# Altium schematic sheet Digital Part.SchDoc
size A3; DocumentNumber: 1; SheetNumber: 1; SheetTotal: 4
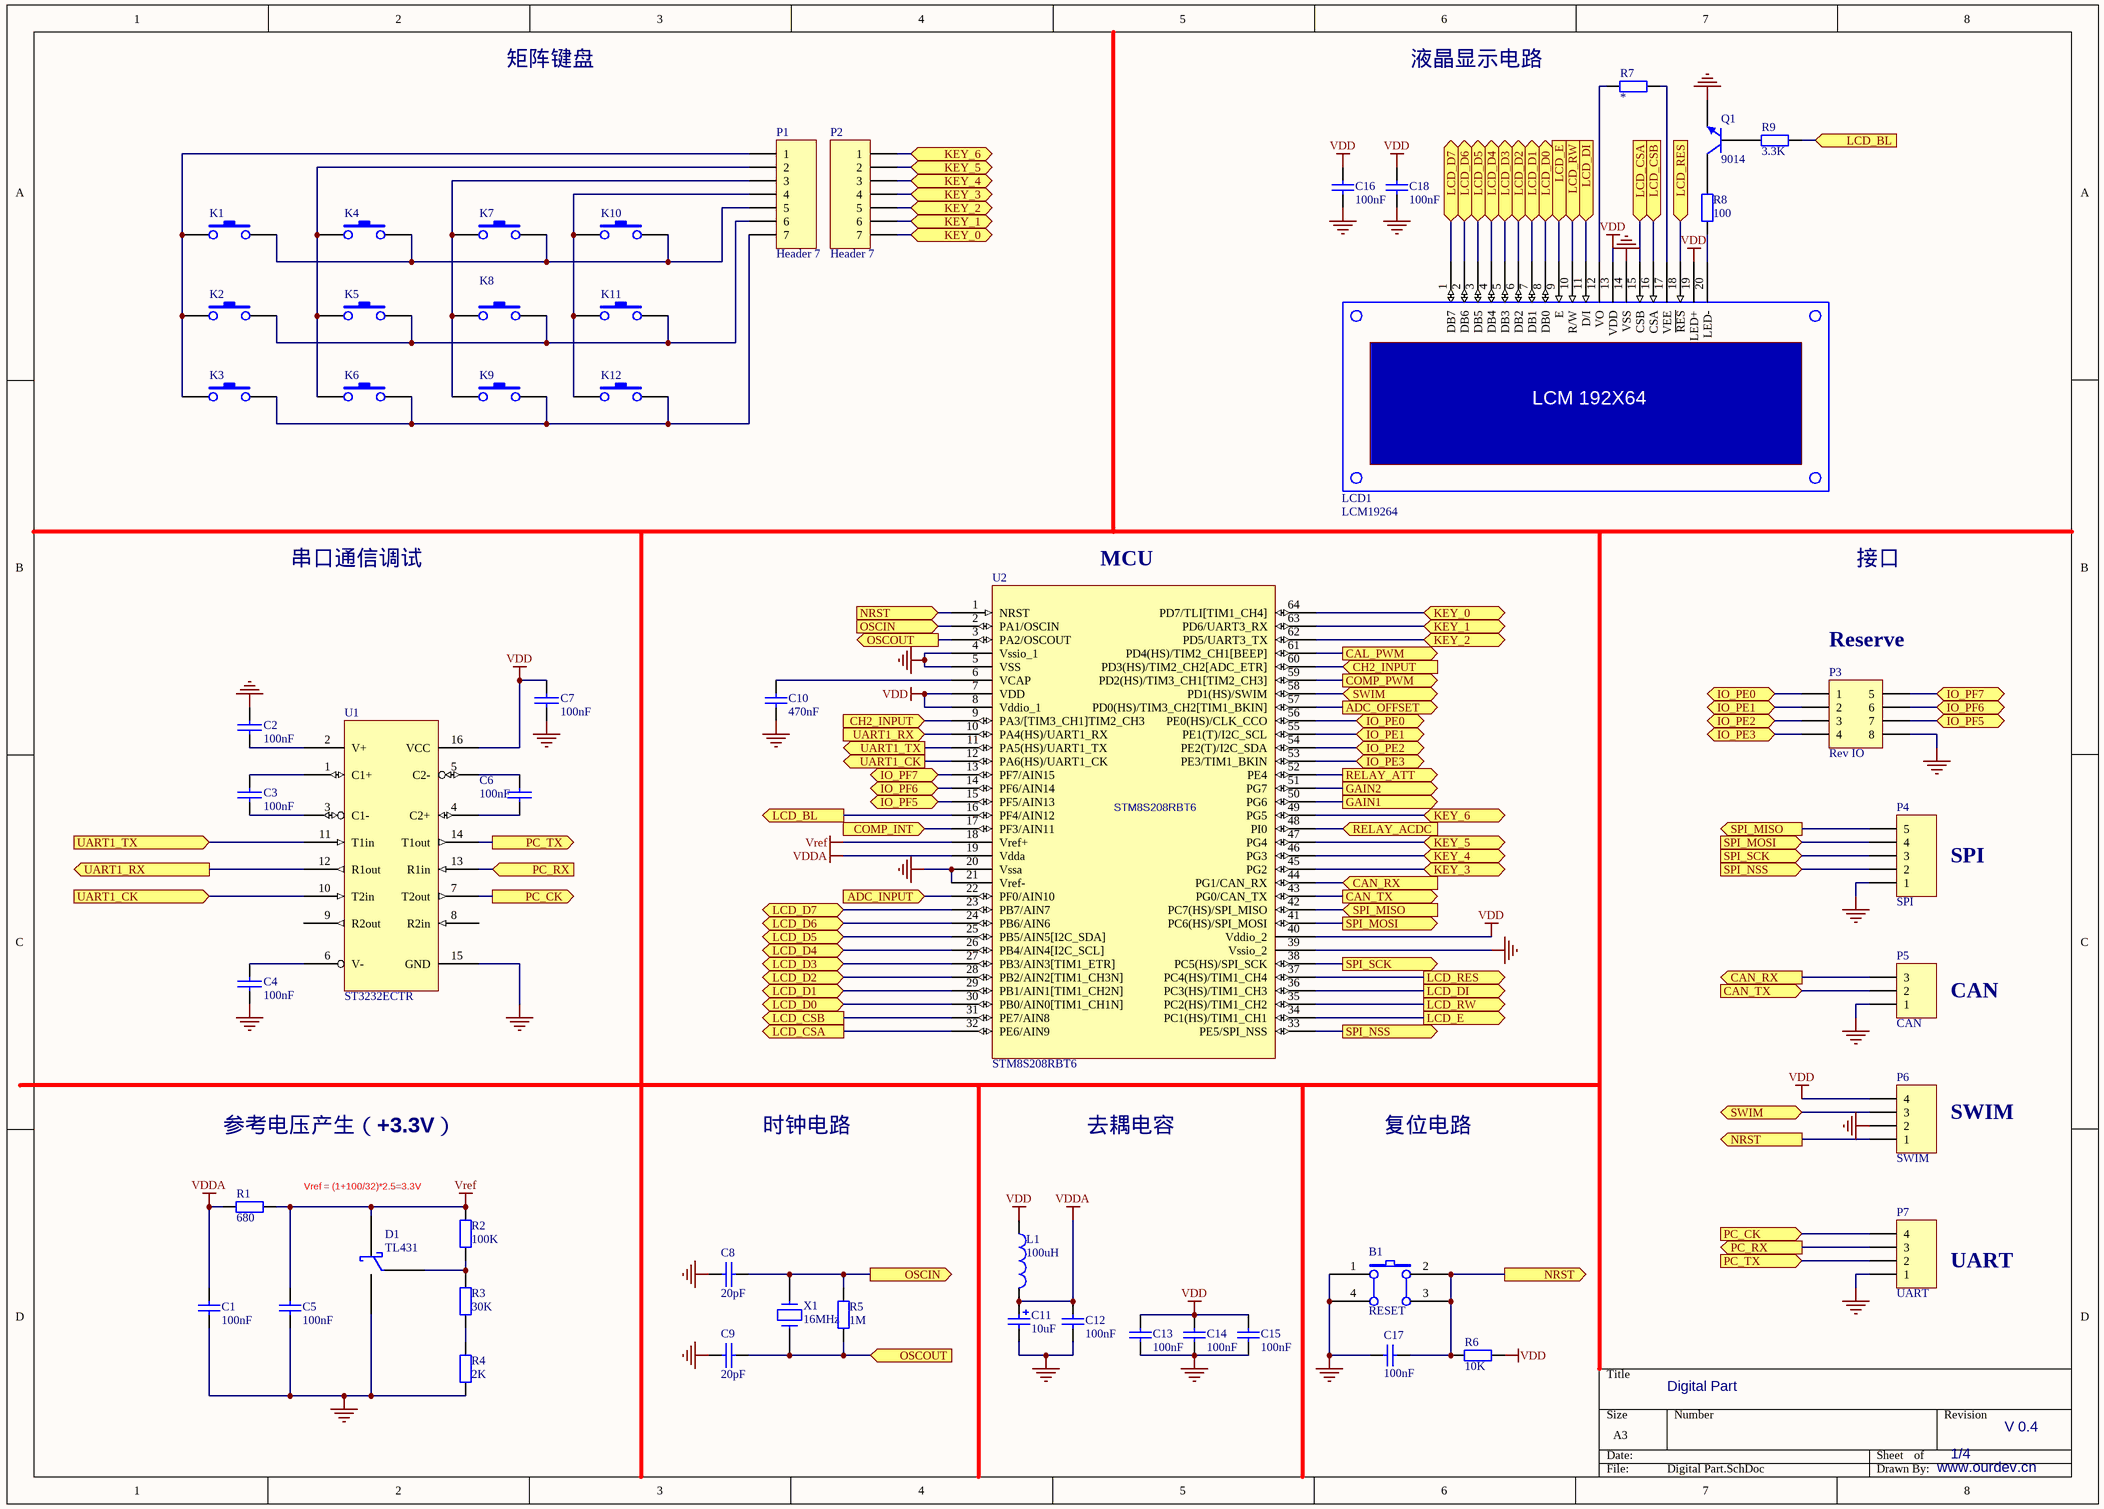
[diagram p0: Digital Part.SchDoc]

## Parts
B1  RESET  [PB-2]
C1  100nF  [CC2012-0805]
C2  100nF  [CC2012-0805]
C3  100nF  [CC2012-0805]
C4  100nF  [CC2012-0805]
C5  100nF  [CC2012-0805]
C6  100nF  [CC2012-0805]
C7  100nF  [CC2012-0805]
C8  20pF  [CC2012-0805]
C9  20pF  [CC2012-0805]
C10  470nF  [CC2012-0805]
C11  10uF  [C-1206]
C12  100nF  [CC2012-0805]
C13  100nF  [CC2012-0805]
C14  100nF  [CC2012-0805]
C15  100nF  [CC2012-0805]
C16  100nF  [CC2012-0805]
C17  100nF  [CC2012-0805]
C18  100nF  [CC2012-0805]
D1  TL431  [SOT-89]
K1  (no value)  [PB-2]
K2  (no value)  [PB-2]
K3  (no value)  [PB-2]
K4  (no value)  [PB-2]
K5  (no value)  [PB-2]
K6  (no value)  [PB-2]
K7  (no value)  [PB-2]
K8  (no value)  [PB-2]
K9  (no value)  [PB-2]
K10  (no value)  [PB-2]
K11  (no value)  [PB-2]
K12  (no value)  [PB-2]
L1  100uH  [L-1206]
LCD1  LCM19264  [HDR2X10]
P1  Header 7  [HDR1X7]
P2  Header 7  [HDR1X7]
P3  Rev IO  [HDR2X4_CEN]
P4  SPI  [HDR1X5]
P5  CAN  [HDR1X3]
P6  SWIM  [HDR1X4]
P7  UART  [HDR1X4]
Q1  9014  [SOT-23]
R1  680  [CR2012-0805]
R2  100K  [CR2012-0805]
R3  30K  [CR2012-0805]
R4  2K  [CR2012-0805]
R5  1M  [CR2012-0805]
R6  10K  [CR2012-0805]
R7  *  [CR2012-0805]
R8  value 100  [CR2012-0805]  (hidden comment: 3.3K)
R9  3.3K  [CR2012-0805]
U1  ST3232ECTR  [SO-16]
U2  STM8S208RBT6  [TQFP-64]
X1  16MHz  [CRYSTAL]

## Ports
ADC_INPUT (in), ADC_OFFSET (out), CAL_PWM (out), CAN_RX (in), CAN_RX (out), CAN_TX (in), CAN_TX (out), CH2_INPUT (in), COMP_INT (in), COMP_PWM (out), GAIN1 (out), GAIN2 (out), IO_PE0 (bidir), IO_PE1 (bidir), IO_PE2 (bidir), IO_PE3 (bidir), IO_PF5 (bidir), IO_PF6 (bidir), IO_PF7 (bidir), KEY_0, KEY_1, KEY_2, KEY_3, KEY_4, KEY_5, KEY_6, LCD_BL (in), LCD_BL (out), LCD_CSA (in), LCD_CSA (out), LCD_CSB (in), LCD_CSB (out), LCD_D0, LCD_D0 (bidir), LCD_D1, LCD_D2, LCD_D2 (bidir), LCD_D3, LCD_D4, LCD_D5, LCD_D6, LCD_D6 (bidir), LCD_D7, LCD_D7 (bidir), LCD_DI (in), LCD_DI (out), LCD_E (in), LCD_E (out), LCD_RES (in), LCD_RES (out), LCD_RW (in), LCD_RW (out), NRST (in), NRST (out), OSCIN (in), OSCIN (out), OSCOUT (in), OSCOUT (out), PC_CK (in), PC_CK (out), PC_RX (in), PC_RX (out), PC_TX (in), PC_TX (out), RELAY_ACDC (in), RELAY_ATT (out), SPI_MISO (in), SPI_MISO (out), SPI_MOSI (in), SPI_MOSI (out), SPI_NSS (in), SPI_NSS (out), SPI_SCK (in), SPI_SCK (out), SWIM (bidir), UART1_CK (in), UART1_CK (out), UART1_RX (in), UART1_RX (out), UART1_TX (in), UART1_TX (out)

## Nets
GND: B1.1(A0) B1.4(A1) C1.2 C2.1 C4.1 C5.2 C7.2 C8.2 C9.2 C10.1 C11.2 C12.2 C13.2 C14.2 C15.2 C16.2 C17.1 C18.2 D1.2(ANODE) LCD1.14(VSS) P3.8 P4.1 P5.1 P6.2 P7.1 Q1.2(E) R4.2 U1.15(GND) U2.4(Vssio_1) U2.5(VSS) U2.20(Vssa) U2.21(Vref-) U2.39(Vssio_2)
VDD: C7.1 C13.1 C14.1 C15.1 C16.1 C18.1 L1.1 LCD1.13(VDD) LCD1.19(LED+) P6.4 R6.1 U1.16(VCC) U2.7(VDD) U2.8(Vddio_1) U2.40(Vddio_2)
VDDA: C1.1 C11.1 C12.1 L1.2 R1.1 U2.19(Vdda)
Vref: C5.1 D1.3(CATHODE) R1.2 R2.1 U2.18(Vref+)
ADC_INPUT: U2.22(PF0/AIN10) ; port ADC_INPUT
ADC_OFFSET: U2.57(PD0(HS)/TIM3_CH2[TIM1_BKIN]) ; port ADC_OFFSET
CAL_PWM: U2.61(PD4(HS)/TIM2_CH1[BEEP]) ; port CAL_PWM
CAN_RX: P5.3 U2.44(PG1/CAN_RX) ; port CAN_RX
CAN_TX: P5.2 U2.43(PG0/CAN_TX) ; port CAN_TX
CH2_INPUT: U2.9(PA3/[TIM3_CH1]TIM2_CH3) U2.60(PD3(HS)/TIM2_CH2[ADC_ETR]) ; port CH2_INPUT
COMP_INT: U2.17(PF3/AIN11) ; port COMP_INT
COMP_PWM: U2.59(PD2(HS)/TIM3_CH1[TIM2_CH3]) ; port COMP_PWM
GAIN1: U2.50(PG6) ; port GAIN1
GAIN2: U2.51(PG7) ; port GAIN2
IO_PE0: P3.1 U2.56(PE0(HS)/CLK_CCO) ; port IO_PE0
IO_PE1: P3.2 U2.55(PE1(T)/I2C_SCL) ; port IO_PE1
IO_PE2: P3.3 U2.54(PE2(T)/I2C_SDA) ; port IO_PE2
IO_PE3: P3.4 U2.53(PE3/TIM1_BKIN) ; port IO_PE3
IO_PF5: P3.7 U2.15(PF5/AIN13) ; port IO_PF5
IO_PF6: P3.6 U2.14(PF6/AIN14) ; port IO_PF6
IO_PF7: P3.5 U2.13(PF7/AIN15) ; port IO_PF7
KEY_0: P2.7 U2.64(PD7/TLI[TIM1_CH4]) ; port KEY_0
KEY_1: P2.6 U2.63(PD6/UART3_RX) ; port KEY_1
KEY_2: P2.5 U2.62(PD5/UART3_TX) ; port KEY_2
KEY_3: P2.4 U2.45(PG2) ; port KEY_3
KEY_4: P2.3 U2.46(PG3) ; port KEY_4
KEY_5: P2.2 U2.47(PG4) ; port KEY_5
KEY_6: P2.1 U2.49(PG5) ; port KEY_6
LCD_BL: R9.1 U2.16(PF4/AIN12) ; port LCD_BL
LCD_CSA: LCD1.15(CSB) U2.32(PE6/AIN9) ; port LCD_CSA
LCD_CSB: LCD1.16(CSA) U2.31(PE7/AIN8) ; port LCD_CSB
LCD_D0: LCD1.8(DB0) U2.30(PB0/AIN0[TIM1_CH1N]) ; port LCD_D0
LCD_D1: LCD1.7(DB1) U2.29(PB1/AIN1[TIM1_CH2N]) ; port LCD_D1
LCD_D2: LCD1.6(DB2) U2.28(PB2/AIN2[TIM1_CH3N]) ; port LCD_D2
LCD_D3: LCD1.5(DB3) U2.27(PB3/AIN3[TIM1_ETR]) ; port LCD_D3
LCD_D4: LCD1.4(DB4) U2.26(PB4/AIN4[I2C_SCL]) ; port LCD_D4
LCD_D5: LCD1.3(DB5) U2.25(PB5/AIN5[I2C_SDA]) ; port LCD_D5
LCD_D6: LCD1.2(DB6) U2.24(PB6/AIN6) ; port LCD_D6
LCD_D7: LCD1.1(DB7) U2.23(PB7/AIN7) ; port LCD_D7
LCD_DI: LCD1.11(D/I) U2.36(PC3(HS)/TIM1_CH3) ; port LCD_DI
LCD_E: LCD1.9(E) U2.34(PC1(HS)/TIM1_CH1) ; port LCD_E
LCD_RES: LCD1.18(~{RES}) U2.37(PC4(HS)/TIM1_CH4) ; port LCD_RES
LCD_RW: LCD1.10(R/W) U2.35(PC2(HS)/TIM1_CH2) ; port LCD_RW
NRST: B1.2(B0) B1.3(B1) C17.2 P6.1 R6.2 U2.1(NRST) ; port NRST
OSCIN: C8.1 R5.2 U2.2(PA1/OSCIN) X1.2 ; port OSCIN
OSCOUT: C9.1 R5.1 U2.3(PA2/OSCOUT) X1.1 ; port OSCOUT
PC_CK: P7.4 U1.7(T2out) ; port PC_CK
PC_RX: P7.3 U1.13(R1in) ; port PC_RX
PC_TX: P7.2 U1.14(T1out) ; port PC_TX
RELAY_ACDC: U2.48(PI0) ; port RELAY_ACDC
RELAY_ATT: U2.52(PE4) ; port RELAY_ATT
SPI_MISO: P4.5 U2.42(PC7(HS)/SPI_MISO) ; port SPI_MISO
SPI_MOSI: P4.4 U2.41(PC6(HS)/SPI_MOSI) ; port SPI_MOSI
SPI_NSS: P4.2 U2.33(PE5/SPI_NSS) ; port SPI_NSS
SPI_SCK: P4.3 U2.38(PC5(HS)/SPI_SCK) ; port SPI_SCK
SWIM: P6.3 U2.58(PD1(HS)/SWIM) ; port SWIM
UART1_CK: U1.10(T2in) U2.12(PA6(HS)/UART1_CK) ; port UART1_CK
UART1_RX: U1.12(R1out) U2.10(PA4(HS)/UART1_RX) ; port UART1_RX
UART1_TX: U1.11(T1in) U2.11(PA5(HS)/UART1_TX) ; port UART1_TX
NetC2_2: C2.2 U1.2(V+)
NetC3_1: C3.1 U1.1(C1+)
NetC3_2: C3.2 U1.3(C1-)
NetC4_2: C4.2 U1.6(V-)
NetC6_1: C6.1 U1.4(C2+)
NetC6_2: C6.2 U1.5(C2-)
NetC10_2: C10.2 U2.6(VCAP)
NetD1_1: D1.1(REF) R2.2 R3.1
NetK1_1: K1.1 K2.1 K3.1 P1.1
NetK1_2: K1.2 K4.2 K7.2 K10.2 P1.5
NetK2_2: K2.2 K5.2 K8.2 K11.2 P1.6
NetK3_2: K3.2 K6.2 K9.2 K12.2 P1.7
NetK4_1: K4.1 K5.1 K6.1 P1.2
NetK7_1: K7.1 K8.1 K9.1 P1.3
NetK10_1: K10.1 K11.1 K12.1 P1.4
NetLCD1_12: LCD1.12(VO) R7.1
NetLCD1_17: LCD1.17(VEE) R7.2
NetLCD1_20: LCD1.20(LED-) R8.2
NetQ1_1: Q1.1(B) R9.2
NetQ1_3: Q1.3(C) R8.1
NetR3_2: R3.2 R4.1

Not connected (* = marked no-connect by the designer): U1 8(R2in) 9(R2out)

## Notes on the sheet
- 矩阵键盘
- 液晶显示电路
- 串口通信调试
- (near U2) MCU
- 接口
- (near P3) Reserve
- SPI
- CAN
- SWIM
- 参考电压产生（+3.3V）
- Vref = (1+100/32)*2.5=3.3V
- 时钟电路
- 去耦电容
- 复位电路
- UART
- Digital Part
- 1/4
- V 0.4
- www.ourdev.cn
- (in symbol LCM19264) LCM 192X64

## Library data of the parts
B1 = SW PUSHBUTTON: SE PUSHBUTTON
C1-C9 C12-C16 C18 = CAP: Capacitor
  C1 C5 C12-C16 C18: Published: 8-Jun-2000; Revision: July-2002: Re-released for DXP Platform.; Publisher: Altium Limited; Value: 100nF
C10 C17 = CAP: Capacitor; Value: 100pF; Published: 8-Jun-2000; Revision: July-2002: Re-released for DXP Platform.; Publisher: Altium Limited
C11 = Cap Pol1: Polarized Capacitor (Radial); Published: 8-Jun-2000; Revision: July-2002: Re-released for DXP Platform.; Publisher: Altium Limited; Value: 10uF
K1-K12 = SW-PB
L1 = Inductor: Published: 8-Jun-2000; Revision: July-2002: Re-released for DXP Platform.; Publisher: Altium Limited; Value: 100uH
P1 P2 = Header 7: Header, 7-Pin; LatestRevisionDate: 17-Jul-2002; LatestRevisionNote: Re-released for DXP Platform.; Publisher: Altium Limited
P3 = Header 4X2A: Header, 4-Pin, Dual row; LatestRevisionDate: 17-Jul-2002; LatestRevisionNote: Re-released for DXP Platform.; Publisher: Altium Limited
P4 = Header 5: Header, 5-Pin; LatestRevisionDate: 17-Jul-2002; LatestRevisionNote: Re-released for DXP Platform.; Publisher: Altium Limited
P5 = Header 3: Header, 3-Pin; LatestRevisionDate: 17-Jul-2002; LatestRevisionNote: Re-released for DXP Platform.; Publisher: Altium Limited
P6 P7 = Header 4: Header, 4-Pin; LatestRevisionDate: 17-Jul-2002; LatestRevisionNote: Re-released for DXP Platform.; Publisher: Altium Limited
Q1 = 2N3904: NPN General Purpose Amplifier; Published: 8-Jun-2000; LatestRevisionDate: 15-Jan-2003; LatestRevisionNote: PCB Footprint 'BCY-W3/D4.7' replaced; DatasheetDocument: 1997; PackageDocument: Sep-1998; PackageReference: TO-92A; Publisher: Altium Limited; Code_JEDEC: TO-92A; ComponentLink1Description: Manufacturer Link; ComponentLink1URL: http://www.fairchildsemi.com/; ComponentLink2Description: Datasheet; ComponentLink2URL: http://www.fairchildsemi.com/ds/2N%2F2N3904.pdf
R1-R9 = Res2: Resistor; Published: 8-Jun-2000; LatestRevisionDate: 17-Jul-2002; LatestRevisionNote: Re-released for DXP Platform.; PackageReference: AXIAL-0.4; Publisher: Altium Limited
  R1: Value: 680
  R2: Value: 100K
  R3: Value: 30K
  R4: Value: 2K
  R5: Value: 1M
  R6: Value: 10K
  R7: Value: *
  R9: Value: 3.3K
U1 = ST3232: 3.3V/5V Dual RS232 Transceiver w/ Int. Cap.
X1 = CRYSTAL